# EAGLE design dsub_to_pins (EAGLE 7.2.0)
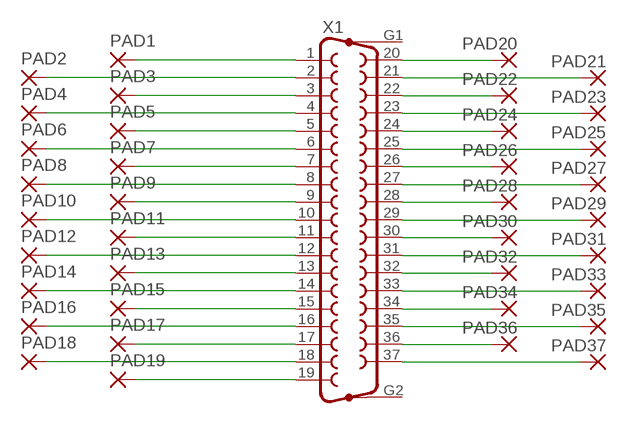
[diagram p0: schematic, sheet 1]

## Parts
PAD1  WIREPAD3,81/1,3  [3,81/1,3]
PAD2  WIREPAD3,81/1,3  [3,81/1,3]
PAD3  WIREPAD3,81/1,3  [3,81/1,3]
PAD4  WIREPAD3,81/1,3  [3,81/1,3]
PAD5  WIREPAD3,81/1,3  [3,81/1,3]
PAD6  WIREPAD3,81/1,3  [3,81/1,3]
PAD7  WIREPAD3,81/1,3  [3,81/1,3]
PAD8  WIREPAD3,81/1,3  [3,81/1,3]
PAD9  WIREPAD3,81/1,3  [3,81/1,3]
PAD10  WIREPAD3,81/1,3  [3,81/1,3]
PAD11  WIREPAD3,81/1,3  [3,81/1,3]
PAD12  WIREPAD3,81/1,3  [3,81/1,3]
PAD13  WIREPAD3,81/1,3  [3,81/1,3]
PAD14  WIREPAD3,81/1,3  [3,81/1,3]
PAD15  WIREPAD3,81/1,3  [3,81/1,3]
PAD16  WIREPAD3,81/1,3  [3,81/1,3]
PAD17  WIREPAD3,81/1,3  [3,81/1,3]
PAD18  WIREPAD3,81/1,3  [3,81/1,3]
PAD19  WIREPAD3,81/1,3  [3,81/1,3]
PAD20  WIREPAD3,81/1,3  [3,81/1,3]
PAD21  WIREPAD3,81/1,3  [3,81/1,3]
PAD22  WIREPAD3,81/1,3  [3,81/1,3]
PAD23  WIREPAD3,81/1,3  [3,81/1,3]
PAD24  WIREPAD3,81/1,3  [3,81/1,3]
PAD25  WIREPAD3,81/1,3  [3,81/1,3]
PAD26  WIREPAD3,81/1,3  [3,81/1,3]
PAD27  WIREPAD3,81/1,3  [3,81/1,3]
PAD28  WIREPAD3,81/1,3  [3,81/1,3]
PAD29  WIREPAD3,81/1,3  [3,81/1,3]
PAD30  WIREPAD3,81/1,3  [3,81/1,3]
PAD31  WIREPAD3,81/1,3  [3,81/1,3]
PAD32  WIREPAD3,81/1,3  [3,81/1,3]
PAD33  WIREPAD3,81/1,3  [3,81/1,3]
PAD34  WIREPAD3,81/1,3  [3,81/1,3]
PAD35  WIREPAD3,81/1,3  [3,81/1,3]
PAD36  WIREPAD3,81/1,3  [3,81/1,3]
PAD37  WIREPAD3,81/1,3  [3,81/1,3]
X1  F37HP  [F37HP]

## Nets
1: PAD1.1(P) X1.1
2: PAD2.1(P) X1.2
3: PAD3.1(P) X1.3
4: PAD4.1(P) X1.4
5: PAD5.1(P) X1.5
6: PAD6.1(P) X1.6
7: PAD7.1(P) X1.7
8: PAD8.1(P) X1.8
9: PAD9.1(P) X1.9
10: PAD10.1(P) X1.10
11: PAD11.1(P) X1.11
12: PAD12.1(P) X1.12
13: PAD13.1(P) X1.13
14: PAD14.1(P) X1.14
15: PAD15.1(P) X1.15
16: PAD16.1(P) X1.16
17: PAD17.1(P) X1.17
18: PAD18.1(P) X1.18
19: PAD19.1(P) X1.19
20: PAD20.1(P) X1.20
21: PAD21.1(P) X1.21
22: PAD22.1(P) X1.22
23: PAD23.1(P) X1.23
24: PAD24.1(P) X1.24
25: PAD25.1(P) X1.25
26: PAD26.1(P) X1.26
27: PAD27.1(P) X1.27
28: PAD28.1(P) X1.28
29: PAD29.1(P) X1.29
30: PAD30.1(P) X1.30
31: PAD31.1(P) X1.31
32: PAD32.1(P) X1.32
33: PAD33.1(P) X1.33
34: PAD34.1(P) X1.34
35: PAD35.1(P) X1.35
36: PAD36.1(P) X1.36
37: PAD37.1(P) X1.37
Unconnected: X1.G1 X1.G2

## Library data of the parts
PAD1-PAD37 = wirepad:WIREPAD: Wire PAD connect wire on PCB
X1 = con-subd:F37HP: SUB-D; OC_FARNELL: unknown; OC_NEWARK: unknown

## Board
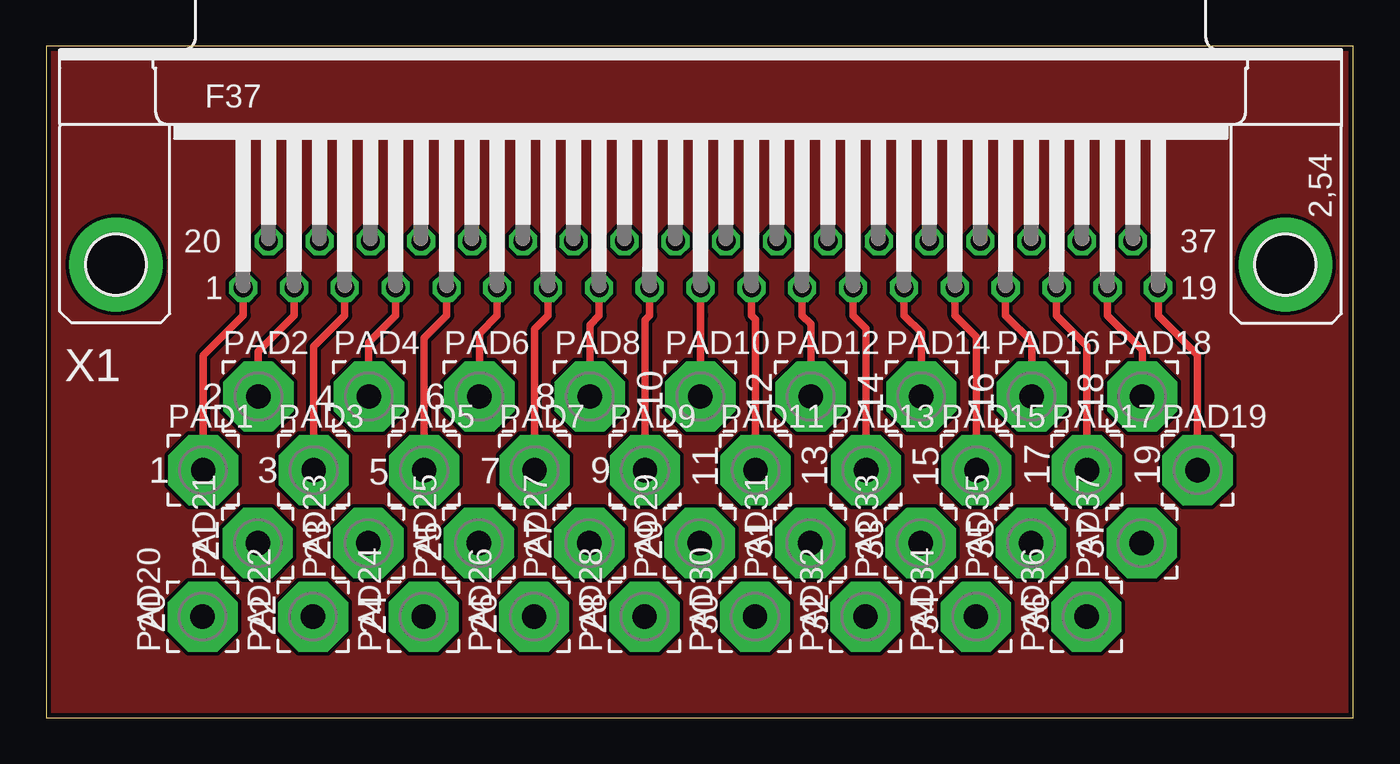
[diagram p1: board, top side]
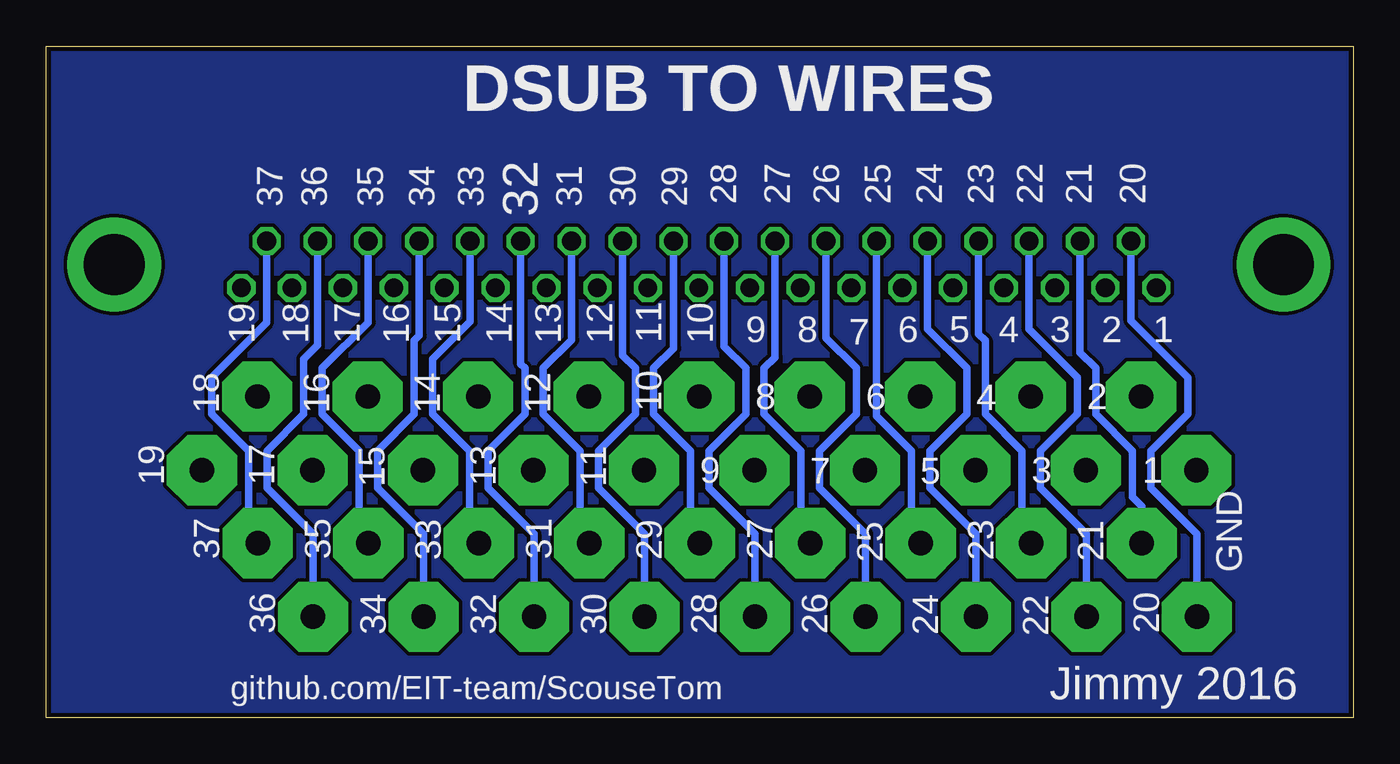
[diagram p2: board, bottom side, seen from below]

Size 71 x 36.5 mm. Coordinates in mm from the lower left corner, seen from the top.
Outline: 0,0 71,0 71,36.5 0,36.5 0,0
Copper layers (1*16): Top 0.035mm / dielectric 1.5mm / Bottom 0.035mm
Design rules "pcbtrain": minimum track width 0.2mm, minimum drill 0.4mm, track to track 0.2mm, track to pad 0.2mm, pad to pad 0.2mm, via to via 0.2mm, smd to smd 0mil, copper to edge 10mil, drill to drill 0.2mm, minimum pad ring 10mil, minimum via ring 10mil, stop-mask expansion 0.125mm, vias tented up to drill 0mil, thermal gap 10mil

### Footprints (pad centres in the part's own frame; a part is rotated, then mirrored left to right if it is on the bottom)
3,81/1,3 = drill 1.321 pad 3.81 octagon: 1 0,0
F37HP = drill 1.016 octagon: 1 -24.841,-1.27; 2 -22.073,-1.27; 3 -19.329,-1.27; 4 -16.561,-1.27; 5 -13.792,-1.27; 6 -11.049,-1.27; 7 -8.28,-1.27; 8 -5.512,-1.27; 9 -2.769,-1.27; 10 0,-1.27; 11 2.769,-1.27; 12 5.512,-1.27; 13 8.28,-1.27; 14 11.049,-1.27; 15 13.818,-1.27; 16 16.561,-1.27; 17 19.329,-1.27; 18 22.098,-1.27; 19 24.841,-1.27; 20 -23.47,1.27; 21 -20.701,1.27; 22 -17.932,1.27; 23 -15.189,1.27; 24 -12.421,1.27; 25 -9.652,1.27; 26 -6.909,1.27; 27 -4.14,1.27; 28 -1.372,1.27; 29 1.372,1.27; 30 4.14,1.27; 31 6.909,1.27; 32 9.677,1.27; 33 12.421,1.27; 34 15.189,1.27; 35 17.958,1.27; 36 20.701,1.27; 37 23.47,1.27 | drill 3.302 pad 5.08: G1 -31.75,0; G2 31.75,0

### Placement (x,y rotation side)
PAD1  8.53,13.46 0 top
PAD2  11.53,17.46 0 top
PAD3  14.53,13.46 0 top
PAD4  17.53,17.46 0 top
PAD5  20.53,13.46 0 top
PAD6  23.53,17.46 0 top
PAD7  26.53,13.46 0 top
PAD8  29.53,17.46 0 top
PAD9  32.53,13.46 0 top
PAD10  35.53,17.46 0 top
PAD11  38.53,13.46 0 top
PAD12  41.53,17.46 0 top
PAD13  44.53,13.46 0 top
PAD14  47.53,17.46 0 top
PAD15  50.53,13.46 0 top
PAD16  53.53,17.46 0 top
PAD17  56.53,13.46 0 top
PAD18  59.53,17.46 0 top
PAD19  62.53,13.46 0 top
PAD20  8.5,5.5 90 top
PAD21  11.5,9.5 90 top
PAD22  14.5,5.5 90 top
PAD23  17.5,9.5 90 top
PAD24  20.5,5.5 90 top
PAD25  23.5,9.5 90 top
PAD26  26.5,5.5 90 top
PAD27  29.5,9.5 90 top
PAD28  32.5,5.5 90 top
PAD29  35.5,9.5 90 top
PAD30  38.5,5.5 90 top
PAD31  41.5,9.5 90 top
PAD32  44.5,5.5 90 top
PAD33  47.5,9.5 90 top
PAD34  50.5,5.5 90 top
PAD35  53.5,9.5 90 top
PAD36  56.5,5.5 90 top
PAD37  59.5,9.5 90 top
X1  35.55,24.63 0 top

### Tracks (layer width: path | path; a pad name or v marks a point on that pad's centre or on a via)
1
  Top 0.406: PAD1.1 8.53,19.68 10.71,21.86 X1.1
2
  Top 0.406: PAD2.1 11.53,19.91 13.48,21.86 X1.2
3
  Top 0.406: PAD3.1 14.53,20.17 16.22,21.86 X1.3
4
  Top 0.406: PAD4.1 17.53,20.4 18.99,21.86 X1.4
5
  Top 0.406: PAD5.1 20.53,20.63 21.76,21.86 X1.5
6
  Top 0.406: PAD6.1 23.53,20.89 24.5,21.86 X1.6
7
  Top 0.406: PAD7.1 26.53,21.12 27.27,21.86 X1.7
8
  Top 0.406: PAD8.1 29.53,21.35 30.04,21.86 X1.8
9
  Top 0.406: PAD9.1 32.53,21.61 32.78,21.86 X1.9
10
  Top 0.406: PAD10.1 35.53,21.84 35.55,21.86 X1.10
11
  Top 0.406: PAD11.1 38.53,21.65 38.32,21.86 X1.11
12
  Top 0.406: PAD12.1 41.53,21.39 41.06,21.86 X1.12
13
  Top 0.406: PAD13.1 44.53,21.16 43.83,21.86 X1.13
14
  Top 0.406: PAD14.1 47.53,20.93 46.6,21.86 X1.14
15
  Top 0.406: PAD15.1 50.53,20.7 49.37,21.86 X1.15
16
  Top 0.406: PAD16.1 53.53,20.44 52.11,21.86 X1.16
17
  Top 0.406: PAD17.1 56.53,20.21 54.88,21.86 X1.17
18
  Top 0.406: PAD18.1 59.53,19.98 57.65,21.86 X1.18
19
  Top 0.406: PAD19.1 62.53,19.72 60.39,21.86 X1.19
20
  Bottom 0.406: PAD20.1 8.5,10 11,12.5 11,14.5 9,16.5 9,18.5 10,19.5 12.08,21.58 X1.20
21
  Bottom 0.406: PAD21.1 11.5,11.5 12,12 12,14.5 14,16.5 14,19 14.85,19.85 X1.21
22
  Bottom 0.406: PAD22.1 14.5,10 17,12.5 17,14.5 15,16.5 15,18.5 17.62,21.12 X1.22
23
  Bottom 0.406: PAD23.1 18,10 18,14.5 20,16.5 20,20.5 20.36,20.86 X1.23
24
  Bottom 0.406: PAD24.1 20.5,10 23,12.5 23,14.5 21,16.5 21,19 23.13,21.13 X1.24
25
  Bottom 0.406: PAD25.1 24,10 24,14.5 25.9,16.4 X1.25
26
  Bottom 0.406: PAD26.1 26.5,10 29,12.5 29,14.5 27,16.5 27,19 28.64,20.64 X1.26
27
  Bottom 0.406: PAD27.1 30,10 30,14.5 32,16.5 32,19 31.41,19.59 X1.27
28
  Bottom 0.406: PAD28.1 32.5,10 35,12.5 35,14.5 33,16.5 33,19 34.18,20.18 X1.28
29
  Bottom 0.406: PAD29.1 36,10 36,14.5 38,16.5 38,19 36.92,20.08 X1.29
30
  Bottom 0.406: PAD30.1 38.5,10 41,12.5 41,14.5 39,16.5 39,19 39.69,19.69 X1.30
31
  Bottom 0.406: PAD31.1 42,10 42,14.5 44,16.5 44,19 42.46,20.54 X1.31
32
  Bottom 0.406: PAD32.1 44.5,10 47,12.5 47,14.5 45,16.5 45,19 45.23,19.23 X1.32
33
  Bottom 0.406: PAD33.1 48,10 48,14.5 50,16.5 50,19.5 47.97,21.53 X1.33
34
  Bottom 0.406: PAD34.1 50.5,10 53,12.5 53,14.5 51,16.5 51,20.5 50.74,20.76 X1.34
35
  Bottom 0.406: PAD35.1 54,10 54,14.5 56,16.5 56,19 53.51,21.49 X1.35
36
  Bottom 0.406: PAD36.1 56.5,10 59,12.5 59,14.5 57,16.5 57,19.5 56.25,20.25 X1.36
37
  Bottom 0.406: PAD37.1 60,10 60,14.5 62,16.5 62,18.5 59.02,21.48 X1.37
GND
  pour Top: 0,36.5 71,36.5 71,0 0,0
  pour Bottom: 0,36.5 71,36.5 71,0 0,0

### Text on the board
bPlace: DSUB TO WIRES | 20 | 21 | 22 | 23 | 24 | 25 | 26 | 27 | 28 | 29 | 30 | 31 | 32 | 33 | 34 | 35 | 36 | 37 | 1 | 2 | 3 | 4 | 5 | 6 | 7 | 8 | 9 | 10 | 11 | 12 | 13 | 14 | 15 | 16 | 17 | 18 | 19 | 10 | 12 | 14 | 16 | 18 | 2 | 4 | 6 | 8 | 11 | 13 | 15 | 17 | 19 | 1 | 3 | 5 | 7 | 9 | GND | 21 | 23 | 25 | 27 | 29 | 31 | 33 | 35 | 37 | 20 | 22 | 24 | 26 | 28 | 30 | 32 | 34 | 36 | Jimmy 2016 | github.com/EIT-team/ScouseTom
tSilk: 10 | 12 | 14 | 16 | 18 | 2 | 4 | 6 | 8 | 11 | 13 | 15 | 17 | 19 | 1 | 3 | 5 | 7 | 9 | 21 | 23 | 25 | 27 | 29 | 31 | 33 | 35 | 37 | 20 | 22 | 24 | 26 | 28 | 30 | 32 | 34 | 36